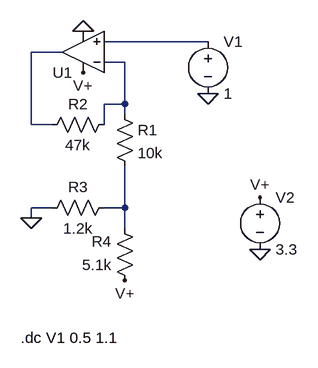
[diagram p0: schematic temp_amp.asc]
temp_amp.asc, the LTspice schematic file:
Version 4
SHEET 1 880 680
WIRE 208 144 48 144
WIRE -16 160 -64 160
WIRE 80 176 48 176
WIRE 80 240 80 176
WIRE 80 240 48 240
WIRE 80 256 80 240
WIRE -64 272 -64 160
WIRE -32 272 -64 272
WIRE 48 272 48 240
WIRE -32 400 -64 400
WIRE 80 400 80 336
WIRE 80 400 48 400
WIRE -64 416 -64 400
WIRE 80 432 80 400
FLAG 16 128 0
FLAG 16 192 V+
FLAG 80 512 V+
FLAG 208 224 0
FLAG 288 464 0
FLAG 288 384 V+
FLAG -64 416 0
SYMBOL OpAmps\\UniversalOpAmp 16 160 R180
SYMATTR InstName U1
SYMBOL res 64 240 R0
SYMATTR InstName R1
SYMATTR Value 10k
SYMBOL res 64 256 R90
WINDOW 0 0 56 VBottom 2
WINDOW 3 32 56 VTop 2
SYMATTR InstName R2
SYMATTR Value 47k
SYMBOL res 64 384 R90
WINDOW 0 0 56 VBottom 2
WINDOW 3 32 56 VTop 2
SYMATTR InstName R3
SYMATTR Value 1.2k
SYMBOL res 96 528 R180
WINDOW 0 36 76 Left 2
WINDOW 3 36 40 Left 2
SYMATTR InstName R4
SYMATTR Value 5.1k
SYMBOL voltage 208 128 R0
WINDOW 123 0 0 Left 0
WINDOW 39 0 0 Left 0
SYMATTR InstName V1
SYMATTR Value 1
SYMBOL voltage 288 368 R0
WINDOW 123 0 0 Left 0
WINDOW 39 0 0 Left 0
SYMATTR InstName V2
SYMATTR Value 3.3
TEXT -80 600 Left 2 !.dc V1 0.5 1.1

The netlist it stands for:
* temp_amp.asc
XU1 N001 N003 V+ 0 N002 level1 Avol=1Meg GBW=10Meg Vos=0 En=0 Enk=0 In=0 Ink=0 Rin=500Meg  ; pins In+ In- V+ V- OUT
R1 N003 N004 10k
R2 N003 N002 47k
R3 N004 0 1.2k
R4 V+ N004 5.1k
V1 N001 0 1
V2 V+ 0 3.3
.dc V1 0.5 1.1
.lib UniversalOpAmp1.lib
.backanno
.end